# EAGLE schematic mask (EAGLE 6.2)
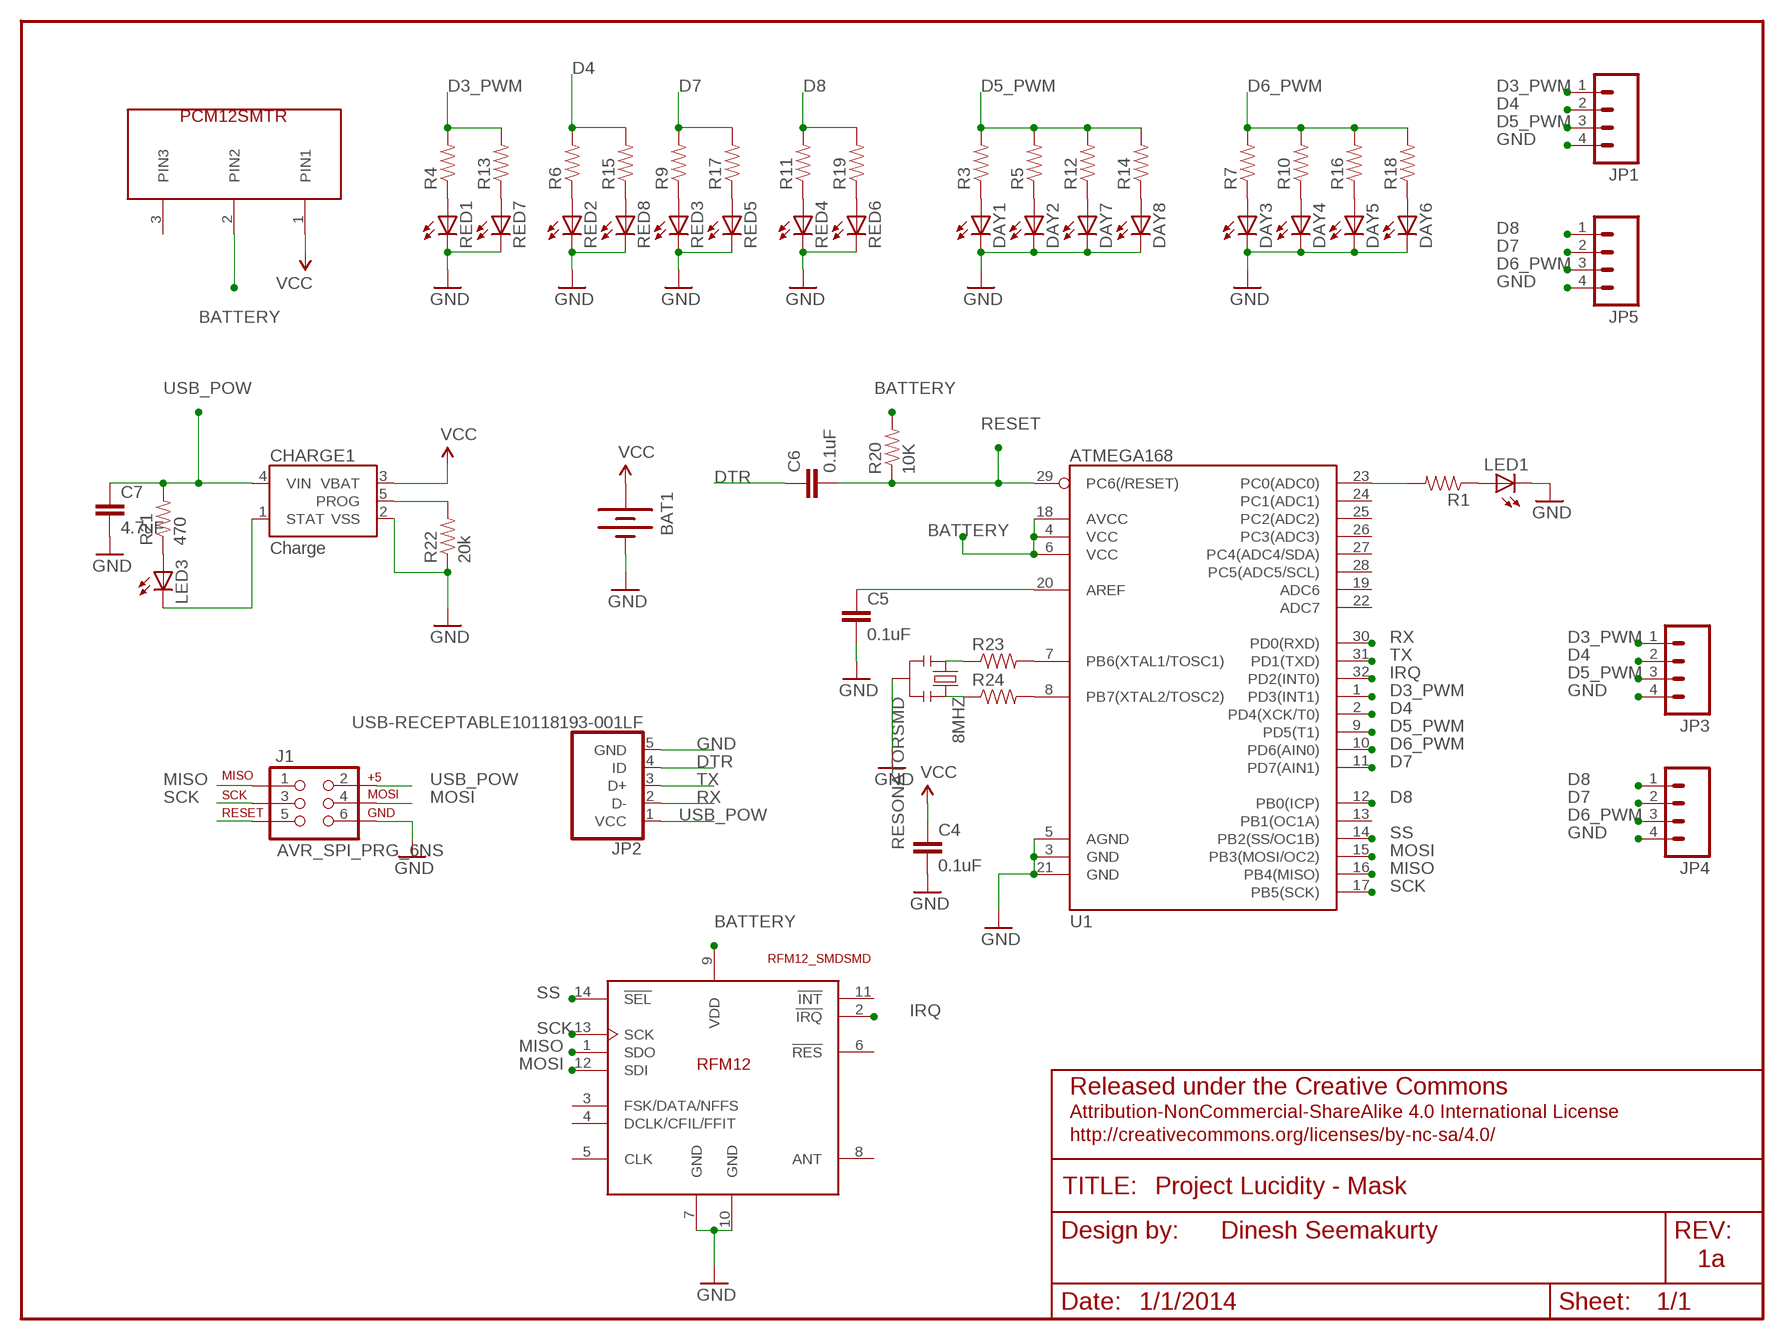
[diagram p0: schematic, sheet 1]

## Parts
8MHZ  RESONATORSMD  [RESONATOR-SMD]
BAT1  BATTERY245MM  [BATTCON_245MM]
C4  0.1uF  CAP0805  [0805]
C5  0.1uF  CAP0805  [0805]
C6  0.1uF  CAP0805  [0805]
C7  4.7uF  CAP0805  [0805]
CHARGE1  Charge  MCP73831  [SOT23-5]
DAY1  LEDP-LCC-2  [P-LCC-2]
DAY2  LEDP-LCC-2  [P-LCC-2]
DAY3  LEDP-LCC-2  [P-LCC-2]
DAY4  LEDP-LCC-2  [P-LCC-2]
DAY5  LEDP-LCC-2  [P-LCC-2]
DAY6  LEDP-LCC-2  [P-LCC-2]
DAY7  LEDP-LCC-2  [P-LCC-2]
DAY8  LEDP-LCC-2  [P-LCC-2]
FRAME1  FRAME-LETTER  [CREATIVE_COMMONS]
J1  AVR_SPI_PRG_6NS  [2X3-NS]
JP1  M04PTH  [1X04]
JP2  USB-RECEPTABLE10118193-001LF  [FCI-10118193-0001LF]
JP3  M04PTH  [1X04]
JP4  M04PTH  [1X04]
JP5  M04PTH  [1X04]
LED1  LED0603  [LED-0603]
LED3  LED0603  [LED-0603]
R1  RESISTOR0805-RES  [0805]
R3  RESISTOR0805-RES  [0805]
R4  RESISTOR0805-RES  [0805]
R5  RESISTOR0805-RES  [0805]
R6  RESISTOR0805-RES  [0805]
R7  RESISTOR0805-RES  [0805]
R9  RESISTOR0805-RES  [0805]
R10  RESISTOR0805-RES  [0805]
R11  RESISTOR0805-RES  [0805]
R12  RESISTOR0805-RES  [0805]
R13  RESISTOR0805-RES  [0805]
R14  RESISTOR0805-RES  [0805]
R15  RESISTOR0805-RES  [0805]
R16  RESISTOR0805-RES  [0805]
R17  RESISTOR0805-RES  [0805]
R18  RESISTOR0805-RES  [0805]
R19  RESISTOR0805-RES  [0805]
R20  10K  RESISTOR0805-RES  [0805]
R21  470  RESISTOR0805-RES  [0805]
R22  20k  RESISTOR0805-RES  [0805]
R23  RESISTOR0402-RES  [0402-RES]
R24  RESISTOR0402-RES  [0402-RES]
RED1  LEDCHIPLED_1206  [CHIPLED_1206]
RED2  LEDCHIPLED_1206  [CHIPLED_1206]
RED3  LEDCHIPLED_1206  [CHIPLED_1206]
RED4  LEDCHIPLED_1206  [CHIPLED_1206]
RED5  LEDCHIPLED_1206  [CHIPLED_1206]
RED6  LEDCHIPLED_1206  [CHIPLED_1206]
RED7  LEDCHIPLED_1206  [CHIPLED_1206]
RED8  LEDCHIPLED_1206  [CHIPLED_1206]
U1  ATMEGA168  [TQFP32-08]
U$2  PCM12SMTR  [PCM12SMTR]
U$3  RFM12_SMDSMD  [RFM12]

## Nets
BATTERY: R20.2 U1.4(VCC) U1.6(VCC) U1.18(AVCC) U$2.2(PIN2) U$3.9(VDD)
D3_PWM: JP1.1 JP3.1 R4.2 R13.2 U1.1(PD3(INT1))
D4: JP1.2 JP3.2 R6.2 R15.2 U1.2(PD4(XCK/T0))
D5_PWM: JP1.3 JP3.3 R3.2 R5.2 R12.2 R14.2 U1.9(PD5(T1))
D6_PWM: JP4.3 JP5.3 R7.2 R10.2 R16.2 R18.2 U1.10(PD6(AIN0))
D7: JP4.2 JP5.2 R9.2 R17.2 U1.11(PD7(AIN1))
D8: JP4.1 JP5.1 R11.2 R19.2 U1.12(PB0(ICP))
DTR: C6.1 JP2.4(ID)
GND: 8MHZ.2 BAT1.2(-) C4.2 C5.2 C7.2 CHARGE1.2(VSS) DAY1.P$2(C) DAY2.P$2(C) DAY3.P$2(C) DAY4.P$2(C) DAY5.P$2(C) DAY6.P$2(C) DAY7.P$2(C) DAY8.P$2(C) J1.6 JP1.4 JP2.5(GND) JP3.4 JP4.4 JP5.4 LED1.C R22.1 RED1.C RED2.C RED3.C RED4.C RED5.C RED6.C RED7.C RED8.C U1.3(GND) U1.5(AGND) U1.21(GND) U$3.7(GND) U$3.10(GND)
IRQ: U1.32(PD2(INT0)) U$3.2(!IRQ)
MISO: J1.1 U1.16(PB4(MISO)) U$3.1(SDO)
MOSI: J1.4 U1.15(PB3(MOSI/OC2)) U$3.12(SDI)
N$1: C5.1 U1.20(AREF)
N$2: LED1.A R1.1
N$3: R1.2 U1.23(PC0(ADC0))
N$10: DAY3.P$1(A) R7.1
N$16: DAY4.P$1(A) R10.1
N$25: DAY1.P$1(A) R3.1
N$26: R4.1 RED1.A
N$27: R6.1 RED2.A
N$28: DAY2.P$1(A) R5.1
N$32: LED3.A R21.1
N$33: R9.1 RED3.A
N$34: R11.1 RED4.A
N$35: CHARGE1.1(STAT) LED3.C
N$36: CHARGE1.5(PROG) R22.2
N$37: 8MHZ.1 R23.1
N$38: 8MHZ.3 R24.1
N$39: R13.1 RED7.A
N$40: R15.1 RED8.A
N$41: R23.2 U1.7(PB6(XTAL1/TOSC1))
N$42: R17.1 RED5.A
N$43: R19.1 RED6.A
N$44: DAY5.P$1(A) R16.1
N$45: DAY6.P$1(A) R18.1
N$46: DAY7.P$1(A) R12.1
N$47: DAY8.P$1(A) R14.1
N$48: R24.2 U1.8(PB7(XTAL2/TOSC2))
RESET: C6.2 J1.5 R20.1 U1.29(PC6(/RESET))
RX: JP2.2(D-) U1.30(PD0(RXD))
SCK: J1.3 U1.17(PB5(SCK)) U$3.13(SCK)
SS: U1.14(PB2(SS/OC1B)) U$3.14(!SEL)
TX: JP2.3(D+) U1.31(PD1(TXD))
USB_POW: C7.1 CHARGE1.4(VIN) J1.2 JP2.1(VCC) R21.2
VCC: BAT1.1(+) C4.1 CHARGE1.3(VBAT) U$2.1(PIN1)
Unconnected: U1.13(PB1(OC1A)) U1.19(ADC6) U1.22(ADC7) U1.24(PC1(ADC1)) U1.25(PC2(ADC2)) U1.26(PC3(ADC3)) U1.27(PC4(ADC4/SDA)) U1.28(PC5(ADC5/SCL)) U$2.3(PIN3) U$3.3(FSK/DATA/NFFS) U$3.4(DCLK/CFIL/FFIT) U$3.5(CLK) U$3.6(!RES) U$3.8(ANT) U$3.11(!INT)

## Notes on the sheet
- Released under the Creative Commons
- Attribution-NonCommercial-ShareAlike 4.0 International License
- http://creativecommons.org/licenses/by-nc-sa/4.0/
- Project Lucidity - Mask
- Dinesh Seemakurty
- 1a
- 1/1/2014

## Library data of the parts
8MHZ = SparkFun-FreqCtrl:RESONATOR: Resonator Small SMD resonator. This is the itty bitty 10/20MHz resonators with built in caps. CSTCE10M0G55 and CSTCE20M0V53. Footprint has been reviewed closely but hasn't been tested yet.
BAT1 = SparkFun-Electromechanical:BATTERY: Battery Holders Various common sizes : AA, AAA, 20mm coin cell and 12mm coin cell.
C4-C7 = SparkFun-Passives:CAP: Capacitor Standard 0603 ceramic capacitor, and 0.1" leaded capacitor.
CHARGE1 = SparkFun-PowerIC:MCP73831: Miniature single cell, fully integrated Li-Ion, Li-polymer charge management controller http://ww1.microchip.com/downloads/en/DeviceDoc/21984a.pdf
DAY1-DAY8 RED1-RED8 = adafruit:LED: LED OSRAM: - CHIPLED LG R971, LG N971, LY N971, LG Q971, LY Q971, LO R971, LY R971 LH N974, LH R974 LS Q976, LO Q976, LY Q976 LO Q996 - Hyper CHIPLED LW Q18S LB Q993, LB Q99A, LB R99A - SideLED LS A670, LO A670, LY A670, LG A670, LP A670 LB A673, LV A673, LT A673, LW A673 LH A674 LY A675 LS A676, LA A676, LO A676, LY A676, LW A676 LS A679, LY A679, LG A679 - Hyper Micro SIDELED® LS Y876, LA Y876, LO Y876, LY Y876 LT Y87S - SmartLED LW L88C, LW L88S LB L89C, LB L89S, LG L890 LS L89K, LO L89K, LY L89K LS L896, LA L896, LO L896, LY L896 - TOPLED LS T670, LO T670, LY T670, LG T670, LP T670 LSG T670, LSP T670, LSY T670, LOP T670, LYG T670 LG T671, LOG T671, LSG T671 LB T673, LV T673, LT T673, LW T673 LH T674 LS T676, LA T676, LO T676, LY T676, LB T676, LH T676, LSB T676, LW T676 LB T67C, LV T67C, LT T67C, LS T67K, LO T67K, LY T67K, LW E67C LS E67B, LA E67B, LO E67B, LY E67B, LB E67C, LV E67C, LT E67C LW T67C LS T679, LY T679, LG T679 LS T770, LO T770, LY T770, LG T770, LP T770 LB T773, LV T773, LT T773, LW T773 LH T774 LS E675, LA E675, LY E675, LS T675 LS T776, LA T776, LO T776, LY T776, LB T776 LHGB T686 LT T68C, LB T68C - Hyper Mini TOPLED® LB M676 - Mini TOPLED Santana® LG M470 LS M47K, LO M47K, LY M47K Source: http://www.osram.convergy.de/
FRAME1 = test:FRAME-LETTER: Schematic Frame Standard 8.5x11 US Letter frame
J1 = Dinesh Custom:AVR_SPI_PRG_6: AVR ISP 6 Pin This is the reduced ISP connector for AVR programming. Common on Arduino. This footprint will take up less PCB space and can be used with a 10-pin to 6-pin adapter such as SKU: BOB-08508
JP1 JP3-JP5 = Dinesh Custom:M04: Header 4 Standard 4-pin 0.1" header. Use with straight break away headers (SKU : PRT-00116), right angle break away headers (PRT-00553), swiss pins (PRT-00743), machine pins (PRT-00117), and female headers (PRT-00115). Molex polarized connector foot print use with SKU : PRT-08231 with associated crimp pins and housings. 1MM SMD Version SKU: PRT-10208
JP2 = Dinesh Custom:USB-RECEPTABLE: USB Receptable
LED1 LED3 = SparkFun-LED:LED: LEDs Standard schematic elements and footprints for 5mm, 3mm, 1206, and 0603 sized LEDs. 5mm - Spark Fun Electronics SKU : COM-00529 (and others)
R1 R3-R7 R9-R24 = SparkFun-Passives:RESISTOR: Resistor Basic schematic elements and footprints for 0603, 1206, and PTH resistors.
U1 = SparkFun-DigitalIC:ATMEGA168: Atmel 32-pin 8-bit micro, 16k flash.
U$2 = Dinesh Custom:PCM12SMTR
U$3 = rfm_12:RFM12_SMD: RFM12 is a low costing ISM band transceiver module implemented with unique PLL. It works signal ranges from 315/433/868/915MHZ bands, comply with FCC, ETSI regulation. The SPI interface is used to communicate with microcontroller for parameter setting.